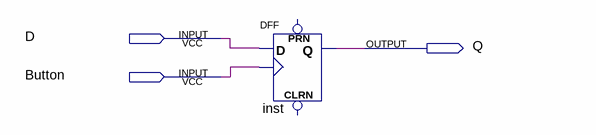
[diagram p0: schematic sheet]
// Quartus schematic scheme3.bdf as structural Verilog: 1 symbols, 3 pins
module scheme3 (
  input  D,
  input  Button,
  output Q
);

  DFF inst (.CLK(Button), .D(D), .Q(Q));  // open: CLRN, PRN
endmodule
